# Altium schematic sheet drivers.SchDoc
size A3; PageSetup: Record=PageOptions|CenterHorizontal=True|CenterVertical=True|PrintScale=1.00|XCorrection=1.00|YCorrection=1.00|PrintKind=1|BorderSize=5000000|LeftOffset=0|BottomOffset=0|Orientation=2|PaperLength=1000|PaperWidth=1000|Scale=100|PaperSource=7|PrintQuality=-4|MediaType=1|DitherType=10|PaperKind=A3|PrintScaleMode=1
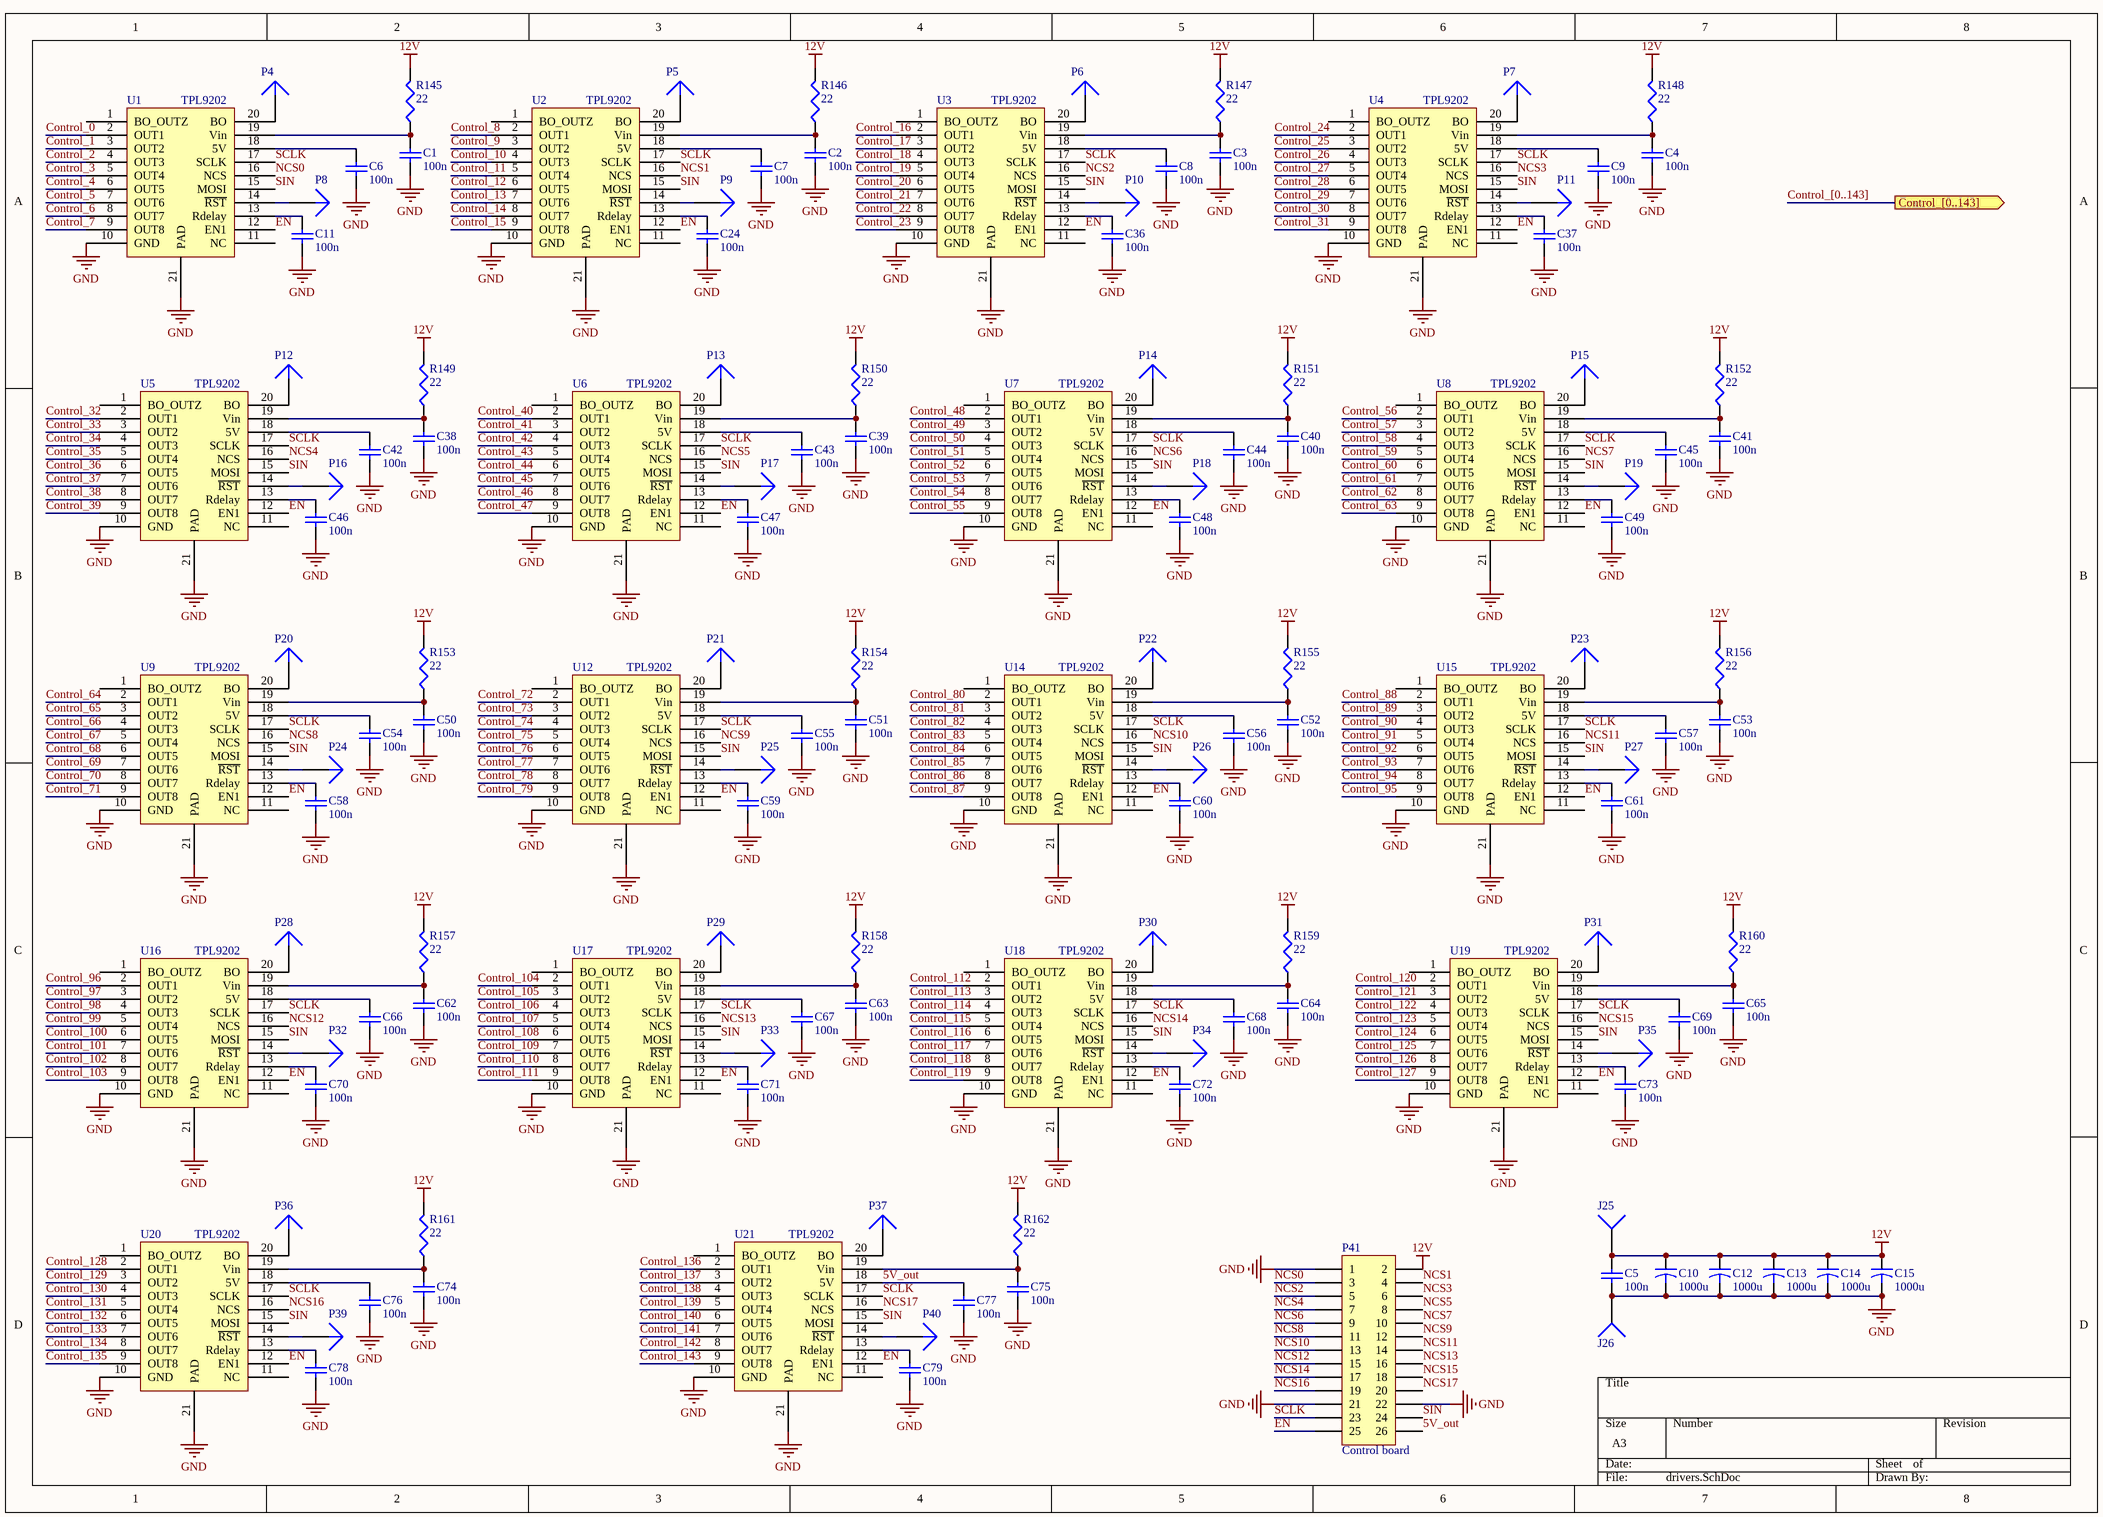
[diagram p0: drivers.SchDoc]

## Parts
C1  value 100n  [1608[0603]]  (hidden comment: Cap Semi)
C2  value 100n  [1608[0603]]  (hidden comment: Cap Semi)
C3  value 100n  [1608[0603]]  (hidden comment: Cap Semi)
C4  value 100n  [1608[0603]]  (hidden comment: Cap Semi)
C5  value 100n  [1608[0603]]  (hidden comment: Cap Semi)
C6  value 100n  [1608[0603]]  (hidden comment: Cap Semi)
C7  value 100n  [1608[0603]]  (hidden comment: Cap Semi)
C8  value 100n  [1608[0603]]  (hidden comment: Cap Semi)
C9  value 100n  [1608[0603]]  (hidden comment: Cap Semi)
C10  value 1000u  [Cap_10x16mm]  (hidden comment: Cap2)
C11  value 100n  [1608[0603]]  (hidden comment: Cap Semi)
C12  value 1000u  [Cap_10x16mm]  (hidden comment: Cap2)
C13  value 1000u  [Cap_10x16mm]  (hidden comment: Cap2)
C14  value 1000u  [Cap_10x16mm]  (hidden comment: Cap2)
C15  value 1000u  [Cap_10x16mm]  (hidden comment: Cap2)
C24  value 100n  [1608[0603]]  (hidden comment: Cap Semi)
C36  value 100n  [1608[0603]]  (hidden comment: Cap Semi)
C37  value 100n  [1608[0603]]  (hidden comment: Cap Semi)
C38  value 100n  [1608[0603]]  (hidden comment: Cap Semi)
C39  value 100n  [1608[0603]]  (hidden comment: Cap Semi)
C40  value 100n  [1608[0603]]  (hidden comment: Cap Semi)
C41  value 100n  [1608[0603]]  (hidden comment: Cap Semi)
C42  value 100n  [1608[0603]]  (hidden comment: Cap Semi)
C43  value 100n  [1608[0603]]  (hidden comment: Cap Semi)
C44  value 100n  [1608[0603]]  (hidden comment: Cap Semi)
C45  value 100n  [1608[0603]]  (hidden comment: Cap Semi)
C46  value 100n  [1608[0603]]  (hidden comment: Cap Semi)
C47  value 100n  [1608[0603]]  (hidden comment: Cap Semi)
C48  value 100n  [1608[0603]]  (hidden comment: Cap Semi)
C49  value 100n  [1608[0603]]  (hidden comment: Cap Semi)
C50  value 100n  [1608[0603]]  (hidden comment: Cap Semi)
C51  value 100n  [1608[0603]]  (hidden comment: Cap Semi)
C52  value 100n  [1608[0603]]  (hidden comment: Cap Semi)
C53  value 100n  [1608[0603]]  (hidden comment: Cap Semi)
C54  value 100n  [1608[0603]]  (hidden comment: Cap Semi)
C55  value 100n  [1608[0603]]  (hidden comment: Cap Semi)
C56  value 100n  [1608[0603]]  (hidden comment: Cap Semi)
C57  value 100n  [1608[0603]]  (hidden comment: Cap Semi)
C58  value 100n  [1608[0603]]  (hidden comment: Cap Semi)
C59  value 100n  [1608[0603]]  (hidden comment: Cap Semi)
C60  value 100n  [1608[0603]]  (hidden comment: Cap Semi)
C61  value 100n  [1608[0603]]  (hidden comment: Cap Semi)
C62  value 100n  [1608[0603]]  (hidden comment: Cap Semi)
C63  value 100n  [1608[0603]]  (hidden comment: Cap Semi)
C64  value 100n  [1608[0603]]  (hidden comment: Cap Semi)
C65  value 100n  [1608[0603]]  (hidden comment: Cap Semi)
C66  value 100n  [1608[0603]]  (hidden comment: Cap Semi)
C67  value 100n  [1608[0603]]  (hidden comment: Cap Semi)
C68  value 100n  [1608[0603]]  (hidden comment: Cap Semi)
C69  value 100n  [1608[0603]]  (hidden comment: Cap Semi)
C70  value 100n  [1608[0603]]  (hidden comment: Cap Semi)
C71  value 100n  [1608[0603]]  (hidden comment: Cap Semi)
C72  value 100n  [1608[0603]]  (hidden comment: Cap Semi)
C73  value 100n  [1608[0603]]  (hidden comment: Cap Semi)
C74  value 100n  [1608[0603]]  (hidden comment: Cap Semi)
C75  value 100n  [1608[0603]]  (hidden comment: Cap Semi)
C76  value 100n  [1608[0603]]  (hidden comment: Cap Semi)
C77  value 100n  [1608[0603]]  (hidden comment: Cap Semi)
C78  value 100n  [1608[0603]]  (hidden comment: Cap Semi)
C79  value 100n  [1608[0603]]  (hidden comment: Cap Semi)
J25  Audio  [Conn_1_2x4]  (value not drawn)
J26  Audio  [Conn_1_2x4]  (value not drawn)
P4  Plug  [PIN1]  (value not drawn)
P5  Plug  [PIN1]  (value not drawn)
P6  Plug  [PIN1]  (value not drawn)
P7  Plug  [PIN1]  (value not drawn)
P8  Plug  [PIN1]  (value not drawn)
P9  Plug  [PIN1]  (value not drawn)
P10  Plug  [PIN1]  (value not drawn)
P11  Plug  [PIN1]  (value not drawn)
P12  Plug  [PIN1]  (value not drawn)
P13  Plug  [PIN1]  (value not drawn)
P14  Plug  [PIN1]  (value not drawn)
P15  Plug  [PIN1]  (value not drawn)
P16  Plug  [PIN1]  (value not drawn)
P17  Plug  [PIN1]  (value not drawn)
P18  Plug  [PIN1]  (value not drawn)
P19  Plug  [PIN1]  (value not drawn)
P20  Plug  [PIN1]  (value not drawn)
P21  Plug  [PIN1]  (value not drawn)
P22  Plug  [PIN1]  (value not drawn)
P23  Plug  [PIN1]  (value not drawn)
P24  Plug  [PIN1]  (value not drawn)
P25  Plug  [PIN1]  (value not drawn)
P26  Plug  [PIN1]  (value not drawn)
P27  Plug  [PIN1]  (value not drawn)
P28  Plug  [PIN1]  (value not drawn)
P29  Plug  [PIN1]  (value not drawn)
P30  Plug  [PIN1]  (value not drawn)
P31  Plug  [PIN1]  (value not drawn)
P32  Plug  [PIN1]  (value not drawn)
P33  Plug  [PIN1]  (value not drawn)
P34  Plug  [PIN1]  (value not drawn)
P35  Plug  [PIN1]  (value not drawn)
P36  Plug  [PIN1]  (value not drawn)
P37  Plug  [PIN1]  (value not drawn)
P39  Plug  [PIN1]  (value not drawn)
P40  Plug  [PIN1]  (value not drawn)
P41  Control board  [HDR2X13]
R145  value 22  [C2512]  (hidden comment: Res3)
R146  value 22  [C2512]  (hidden comment: Res3)
R147  value 22  [C2512]  (hidden comment: Res3)
R148  value 22  [C2512]  (hidden comment: Res3)
R149  value 22  [C2512]  (hidden comment: Res3)
R150  value 22  [C2512]  (hidden comment: Res3)
R151  value 22  [C2512]  (hidden comment: Res3)
R152  value 22  [C2512]  (hidden comment: Res3)
R153  value 22  [C2512]  (hidden comment: Res3)
R154  value 22  [C2512]  (hidden comment: Res3)
R155  value 22  [C2512]  (hidden comment: Res3)
R156  value 22  [C2512]  (hidden comment: Res3)
R157  value 22  [C2512]  (hidden comment: Res3)
R158  value 22  [C2512]  (hidden comment: Res3)
R159  value 22  [C2512]  (hidden comment: Res3)
R160  value 22  [C2512]  (hidden comment: Res3)
R161  value 22  [C2512]  (hidden comment: Res3)
R162  value 22  [C2512]  (hidden comment: Res3)
U1  TPL9202  [HSSOP20]
U2  TPL9202  [HSSOP20]
U3  TPL9202  [HSSOP20]
U4  TPL9202  [HSSOP20]
U5  TPL9202  [HSSOP20]
U6  TPL9202  [HSSOP20]
U7  TPL9202  [HSSOP20]
U8  TPL9202  [HSSOP20]
U9  TPL9202  [HSSOP20]
U12  TPL9202  [HSSOP20]
U14  TPL9202  [HSSOP20]
U15  TPL9202  [HSSOP20]
U16  TPL9202  [HSSOP20]
U17  TPL9202  [HSSOP20]
U18  TPL9202  [HSSOP20]
U19  TPL9202  [HSSOP20]
U20  TPL9202  [HSSOP20]
U21  TPL9202  [HSSOP20]

## Ports
Control_[0..143] (out)

## Nets
12V: C5.1 C10.1 C12.1 C13.1 C14.1 C15.1 J25.1 P41.2 R145.2 R146.2 R147.2 R148.2 R149.2 R150.2 R151.2 R152.2 R153.2 R154.2 R155.2 R156.2 R157.2 R158.2 R159.2 R160.2 R161.2 R162.2
GND: C1.1 C2.1 C3.1 C4.1 C5.2 C6.1 C7.1 C8.1 C9.1 C10.2 C11.1 C12.2 C13.2 C14.2 C15.2 C24.1 C36.1 C37.1 C38.1 C39.1 C40.1 C41.1 C42.1 C43.1 C44.1 C45.1 C46.1 C47.1 C48.1 C49.1 C50.1 C51.1 C52.1 C53.1 C54.1 C55.1 C56.1 C57.1 C58.1 C59.1 C60.1 C61.1 C62.1 C63.1 C64.1 C65.1 C66.1 C67.1 C68.1 C69.1 C70.1 C71.1 C72.1 C73.1 C74.1 C75.1 C76.1 C77.1 C78.1 C79.1 J26.1 P41.1 P41.21 P41.22 U1.10(GND) U1.21(PAD) U2.10(GND) U2.21(PAD) U3.10(GND) U3.21(PAD) U4.10(GND) U4.21(PAD) U5.10(GND) U5.21(PAD) U6.10(GND) U6.21(PAD) U7.10(GND) U7.21(PAD) U8.10(GND) U8.21(PAD) U9.10(GND) U9.21(PAD) U12.10(GND) U12.21(PAD) U14.10(GND) U14.21(PAD) U15.10(GND) U15.21(PAD) U16.10(GND) U16.21(PAD) U17.10(GND) U17.21(PAD) U18.10(GND) U18.21(PAD) U19.10(GND) U19.21(PAD) U20.10(GND) U20.21(PAD) U21.10(GND) U21.21(PAD)
5V_out: C77.2 P41.26 U21.18(5V)
Control_0: U1.2(OUT1)
Control_1: U1.3(OUT2)
Control_2: U1.4(OUT3)
Control_3: U1.5(OUT4)
Control_4: U1.6(OUT5)
Control_5: U1.7(OUT6)
Control_6: U1.8(OUT7)
Control_7: U1.9(OUT8)
Control_8: U2.2(OUT1)
Control_9: U2.3(OUT2)
Control_10: U2.4(OUT3)
Control_11: U2.5(OUT4)
Control_12: U2.6(OUT5)
Control_13: U2.7(OUT6)
Control_14: U2.8(OUT7)
Control_15: U2.9(OUT8)
Control_16: U3.2(OUT1)
Control_17: U3.3(OUT2)
Control_18: U3.4(OUT3)
Control_19: U3.5(OUT4)
Control_20: U3.6(OUT5)
Control_21: U3.7(OUT6)
Control_22: U3.8(OUT7)
Control_23: U3.9(OUT8)
Control_24: U4.2(OUT1)
Control_25: U4.3(OUT2)
Control_26: U4.4(OUT3)
Control_27: U4.5(OUT4)
Control_28: U4.6(OUT5)
Control_29: U4.7(OUT6)
Control_30: U4.8(OUT7)
Control_31: U4.9(OUT8)
Control_32: U5.2(OUT1)
Control_33: U5.3(OUT2)
Control_34: U5.4(OUT3)
Control_35: U5.5(OUT4)
Control_36: U5.6(OUT5)
Control_37: U5.7(OUT6)
Control_38: U5.8(OUT7)
Control_39: U5.9(OUT8)
Control_40: U6.2(OUT1)
Control_41: U6.3(OUT2)
Control_42: U6.4(OUT3)
Control_43: U6.5(OUT4)
Control_44: U6.6(OUT5)
Control_45: U6.7(OUT6)
Control_46: U6.8(OUT7)
Control_47: U6.9(OUT8)
Control_48: U7.2(OUT1)
Control_49: U7.3(OUT2)
Control_50: U7.4(OUT3)
Control_51: U7.5(OUT4)
Control_52: U7.6(OUT5)
Control_53: U7.7(OUT6)
Control_54: U7.8(OUT7)
Control_55: U7.9(OUT8)
Control_56: U8.2(OUT1)
Control_57: U8.3(OUT2)
Control_58: U8.4(OUT3)
Control_59: U8.5(OUT4)
Control_60: U8.6(OUT5)
Control_61: U8.7(OUT6)
Control_62: U8.8(OUT7)
Control_63: U8.9(OUT8)
Control_64: U9.2(OUT1)
Control_65: U9.3(OUT2)
Control_66: U9.4(OUT3)
Control_67: U9.5(OUT4)
Control_68: U9.6(OUT5)
Control_69: U9.7(OUT6)
Control_70: U9.8(OUT7)
Control_71: U9.9(OUT8)
Control_72: U12.2(OUT1)
Control_73: U12.3(OUT2)
Control_74: U12.4(OUT3)
Control_75: U12.5(OUT4)
Control_76: U12.6(OUT5)
Control_77: U12.7(OUT6)
Control_78: U12.8(OUT7)
Control_79: U12.9(OUT8)
Control_80: U14.2(OUT1)
Control_81: U14.3(OUT2)
Control_82: U14.4(OUT3)
Control_83: U14.5(OUT4)
Control_84: U14.6(OUT5)
Control_85: U14.7(OUT6)
Control_86: U14.8(OUT7)
Control_87: U14.9(OUT8)
Control_88: U15.2(OUT1)
Control_89: U15.3(OUT2)
Control_90: U15.4(OUT3)
Control_91: U15.5(OUT4)
Control_92: U15.6(OUT5)
Control_93: U15.7(OUT6)
Control_94: U15.8(OUT7)
Control_95: U15.9(OUT8)
Control_96: U16.2(OUT1)
Control_97: U16.3(OUT2)
Control_98: U16.4(OUT3)
Control_99: U16.5(OUT4)
Control_100: U16.6(OUT5)
Control_101: U16.7(OUT6)
Control_102: U16.8(OUT7)
Control_103: U16.9(OUT8)
Control_104: U17.2(OUT1)
Control_105: U17.3(OUT2)
Control_106: U17.4(OUT3)
Control_107: U17.5(OUT4)
Control_108: U17.6(OUT5)
Control_109: U17.7(OUT6)
Control_110: U17.8(OUT7)
Control_111: U17.9(OUT8)
Control_112: U18.2(OUT1)
Control_113: U18.3(OUT2)
Control_114: U18.4(OUT3)
Control_115: U18.5(OUT4)
Control_116: U18.6(OUT5)
Control_117: U18.7(OUT6)
Control_118: U18.8(OUT7)
Control_119: U18.9(OUT8)
Control_120: U19.2(OUT1)
Control_121: U19.3(OUT2)
Control_122: U19.4(OUT3)
Control_123: U19.5(OUT4)
Control_124: U19.6(OUT5)
Control_125: U19.7(OUT6)
Control_126: U19.8(OUT7)
Control_127: U19.9(OUT8)
Control_128: U20.2(OUT1)
Control_129: U20.3(OUT2)
Control_130: U20.4(OUT3)
Control_131: U20.5(OUT4)
Control_132: U20.6(OUT5)
Control_133: U20.7(OUT6)
Control_134: U20.8(OUT7)
Control_135: U20.9(OUT8)
Control_136: U21.2(OUT1)
Control_137: U21.3(OUT2)
Control_138: U21.4(OUT3)
Control_139: U21.5(OUT4)
Control_140: U21.6(OUT5)
Control_141: U21.7(OUT6)
Control_142: U21.8(OUT7)
Control_143: U21.9(OUT8)
EN: P41.25 U1.12(EN1) U2.12(EN1) U3.12(EN1) U4.12(EN1) U5.12(EN1) U6.12(EN1) U7.12(EN1) U8.12(EN1) U9.12(EN1) U12.12(EN1) U14.12(EN1) U15.12(EN1) U16.12(EN1) U17.12(EN1) U18.12(EN1) U19.12(EN1) U20.12(EN1) U21.12(EN1)
NCS0: P41.3 U1.16(NCS)
NCS1: P41.4 U2.16(NCS)
NCS2: P41.5 U3.16(NCS)
NCS3: P41.6 U4.16(NCS)
NCS4: P41.7 U5.16(NCS)
NCS5: P41.8 U6.16(NCS)
NCS6: P41.9 U7.16(NCS)
NCS7: P41.10 U8.16(NCS)
NCS8: P41.11 U9.16(NCS)
NCS9: P41.12 U12.16(NCS)
NCS10: P41.13 U14.16(NCS)
NCS11: P41.14 U15.16(NCS)
NCS12: P41.15 U16.16(NCS)
NCS13: P41.16 U17.16(NCS)
NCS14: P41.17 U18.16(NCS)
NCS15: P41.18 U19.16(NCS)
NCS16: P41.19 U20.16(NCS)
NCS17: P41.20 U21.16(NCS)
SCLK: P41.23 U1.17(SCLK) U2.17(SCLK) U3.17(SCLK) U4.17(SCLK) U5.17(SCLK) U6.17(SCLK) U7.17(SCLK) U8.17(SCLK) U9.17(SCLK) U12.17(SCLK) U14.17(SCLK) U15.17(SCLK) U16.17(SCLK) U17.17(SCLK) U18.17(SCLK) U19.17(SCLK) U20.17(SCLK) U21.17(SCLK)
SIN: P41.24 U1.15(MOSI) U2.15(MOSI) U3.15(MOSI) U4.15(MOSI) U5.15(MOSI) U6.15(MOSI) U7.15(MOSI) U8.15(MOSI) U9.15(MOSI) U12.15(MOSI) U14.15(MOSI) U15.15(MOSI) U16.15(MOSI) U17.15(MOSI) U18.15(MOSI) U19.15(MOSI) U20.15(MOSI) U21.15(MOSI)
NetC1_2: C1.2 R145.1 U1.19(Vin)
NetC2_2: C2.2 R146.1 U2.19(Vin)
NetC3_2: C3.2 R147.1 U3.19(Vin)
NetC4_2: C4.2 R148.1 U4.19(Vin)
NetC6_2: C6.2 U1.18(5V)
NetC7_2: C7.2 U2.18(5V)
NetC8_2: C8.2 U3.18(5V)
NetC9_2: C9.2 U4.18(5V)
NetC11_2: C11.2 U1.13(Rdelay)
NetC24_2: C24.2 U2.13(Rdelay)
NetC36_2: C36.2 U3.13(Rdelay)
NetC37_2: C37.2 U4.13(Rdelay)
NetC38_2: C38.2 R149.1 U5.19(Vin)
NetC39_2: C39.2 R150.1 U6.19(Vin)
NetC40_2: C40.2 R151.1 U7.19(Vin)
NetC41_2: C41.2 R152.1 U8.19(Vin)
NetC42_2: C42.2 U5.18(5V)
NetC43_2: C43.2 U6.18(5V)
NetC44_2: C44.2 U7.18(5V)
NetC45_2: C45.2 U8.18(5V)
NetC46_2: C46.2 U5.13(Rdelay)
NetC47_2: C47.2 U6.13(Rdelay)
NetC48_2: C48.2 U7.13(Rdelay)
NetC49_2: C49.2 U8.13(Rdelay)
NetC50_2: C50.2 R153.1 U9.19(Vin)
NetC51_2: C51.2 R154.1 U12.19(Vin)
NetC52_2: C52.2 R155.1 U14.19(Vin)
NetC53_2: C53.2 R156.1 U15.19(Vin)
NetC54_2: C54.2 U9.18(5V)
NetC55_2: C55.2 U12.18(5V)
NetC56_2: C56.2 U14.18(5V)
NetC57_2: C57.2 U15.18(5V)
NetC58_2: C58.2 U9.13(Rdelay)
NetC59_2: C59.2 U12.13(Rdelay)
NetC60_2: C60.2 U14.13(Rdelay)
NetC61_2: C61.2 U15.13(Rdelay)
NetC62_2: C62.2 R157.1 U16.19(Vin)
NetC63_2: C63.2 R158.1 U17.19(Vin)
NetC64_2: C64.2 R159.1 U18.19(Vin)
NetC65_2: C65.2 R160.1 U19.19(Vin)
NetC66_2: C66.2 U16.18(5V)
NetC67_2: C67.2 U17.18(5V)
NetC68_2: C68.2 U18.18(5V)
NetC69_2: C69.2 U19.18(5V)
NetC70_2: C70.2 U16.13(Rdelay)
NetC71_2: C71.2 U17.13(Rdelay)
NetC72_2: C72.2 U18.13(Rdelay)
NetC73_2: C73.2 U19.13(Rdelay)
NetC74_2: C74.2 R161.1 U20.19(Vin)
NetC75_2: C75.2 R162.1 U21.19(Vin)
NetC76_2: C76.2 U20.18(5V)
NetC78_2: C78.2 U20.13(Rdelay)
NetC79_2: C79.2 U21.13(Rdelay)
NetP4_1: P4.1 U1.20(BO)
NetP5_1: P5.1 U2.20(BO)
NetP6_1: P6.1 U3.20(BO)
NetP7_1: P7.1 U4.20(BO)
NetP8_1: P8.1 U1.14(~{RST})
NetP9_1: P9.1 U2.14(~{RST})
NetP10_1: P10.1 U3.14(~{RST})
NetP11_1: P11.1 U4.14(~{RST})
NetP12_1: P12.1 U5.20(BO)
NetP13_1: P13.1 U6.20(BO)
NetP14_1: P14.1 U7.20(BO)
NetP15_1: P15.1 U8.20(BO)
NetP16_1: P16.1 U5.14(~{RST})
NetP17_1: P17.1 U6.14(~{RST})
NetP18_1: P18.1 U7.14(~{RST})
NetP19_1: P19.1 U8.14(~{RST})
NetP20_1: P20.1 U9.20(BO)
NetP21_1: P21.1 U12.20(BO)
NetP22_1: P22.1 U14.20(BO)
NetP23_1: P23.1 U15.20(BO)
NetP24_1: P24.1 U9.14(~{RST})
NetP25_1: P25.1 U12.14(~{RST})
NetP26_1: P26.1 U14.14(~{RST})
NetP27_1: P27.1 U15.14(~{RST})
NetP28_1: P28.1 U16.20(BO)
NetP29_1: P29.1 U17.20(BO)
NetP30_1: P30.1 U18.20(BO)
NetP31_1: P31.1 U19.20(BO)
NetP32_1: P32.1 U16.14(~{RST})
NetP33_1: P33.1 U17.14(~{RST})
NetP34_1: P34.1 U18.14(~{RST})
NetP35_1: P35.1 U19.14(~{RST})
NetP36_1: P36.1 U20.20(BO)
NetP37_1: P37.1 U21.20(BO)
NetP39_1: P39.1 U20.14(~{RST})
NetP40_1: P40.1 U21.14(~{RST})

Not connected (* = marked no-connect by the designer): U1 1(BO_OUTZ) 11(NC); U2 1(BO_OUTZ) 11(NC); U3 1(BO_OUTZ) 11(NC); U4 1(BO_OUTZ) 11(NC); U5 1(BO_OUTZ) 11(NC); U6 1(BO_OUTZ) 11(NC); U7 1(BO_OUTZ) 11(NC); U8 1(BO_OUTZ) 11(NC); U9 1(BO_OUTZ) 11(NC); U12 1(BO_OUTZ) 11(NC); U14 1(BO_OUTZ) 11(NC); U15 1(BO_OUTZ) 11(NC); U16 1(BO_OUTZ) 11(NC); U17 1(BO_OUTZ) 11(NC); U18 1(BO_OUTZ) 11(NC); U19 1(BO_OUTZ) 11(NC); U20 1(BO_OUTZ) 11(NC); U21 1(BO_OUTZ) 11(NC)

## Buses and harness runs
bus Control_[0..143] = port Control_[0..143]

## Library data of the parts
C1-C9 C11 C24 C36-C79 = Cap Semi: Capacitor (Semiconductor SIM Model); Published: 8-Jun-2000; LatestRevisionDate: 29-May-2009; LatestRevisionNote: IPC-7351 Footprint Added.; PackageReference: C1206; Publisher: Altium Limited; PackageDescription: Chip Capacitor
C10 C12-C15 = Cap2: Capacitor; Published: 23-Sep-2002; PackageReference: CAPR5-4X5; Publisher: Altium Limited; PackageDescription: Capacitor; 2 Leads
J25 J26 = Socket: LatestRevisionDate: 17-Jul-2002; LatestRevisionNote: Re-released for DXP Platform.; Publisher: Altium Limited
P41 = Header 13X2: Header, 13-Pin, Dual row; LatestRevisionDate: 17-Jul-2002; LatestRevisionNote: Re-released for DXP Platform.; Publisher: Altium Limited
R145-R162 = Res3: Resistor; Published: 8-Jun-2000; LatestRevisionDate: 29-May-2009; LatestRevisionNote: IPC-7351 Footprint Added.; PackageReference: J1-0603; Publisher: Altium Limited; PackageDescription: Chip Resistor
U1-U9 U12 U14-U21 = TPL9202: 8-CHANNEL RELAY DRIVER  WITH INTEGRATED 5-V LDO AND BROWN-OUT DETECTION; Part number: 809-5425
P4-P37 P39 P40 = Plug: LatestRevisionDate: 17-Jul-2002; LatestRevisionNote: Re-released for DXP Platform.; Publisher: Altium Limited